# Altium schematic sheet Decoupling_Capacitors.SchDoc
size A4
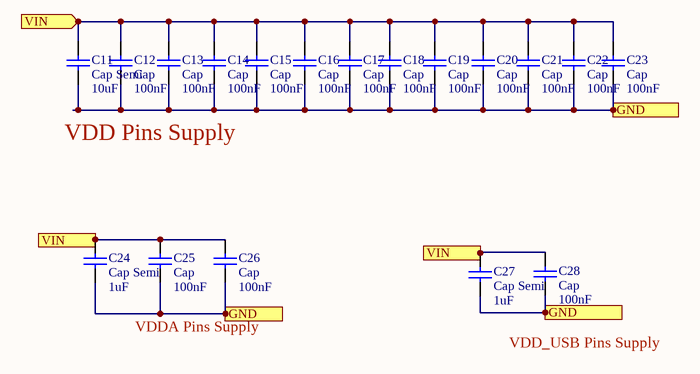
[diagram p0: Decoupling_Capacitors.SchDoc]

## Parts
C11  Cap Semi  value 10uF  [CAP_TANT1206]
C12  Cap  value 100nF  [0402]
C13  Cap  value 100nF  [0402]
C14  Cap  value 100nF  [0402]
C15  Cap  value 100nF  [0402]
C16  Cap  value 100nF  [0402]
C17  Cap  value 100nF  [0402]
C18  Cap  value 100nF  [0402]
C19  Cap  value 100nF  [0402]
C20  Cap  value 100nF  [0402]
C21  Cap  value 100nF  [0402]
C22  Cap  value 100nF  [0402]
C23  Cap  value 100nF  [0402]
C24  Cap Semi  value 1uF  [0402]
C25  Cap  value 100nF  [0402]
C26  Cap  value 100nF  [0402]
C27  Cap Semi  value 1uF  [0402]
C28  Cap  value 100nF  [0402]

## Ports
GND (out), VIN, VIN (in)

## Nets
GND: C11.1 C12.1 C13.1 C14.1 C15.1 C16.1 C17.1 C18.1 C19.1 C20.1 C21.1 C22.1 C23.1 C25.1 C26.1 C27.1 C28.1 ; port GND
VIN: C11.2 C12.2 C13.2 C14.2 C15.2 C16.2 C17.2 C18.2 C19.2 C20.2 C21.2 C22.2 C23.2 C24.2 C25.2 C26.2 C27.2 C28.2 ; port VIN

Not connected (* = marked no-connect by the designer): C24 1

## Notes on the sheet
- VDD Pins Supply
- VDDA Pins Supply
- VDD_USB Pins Supply

## Library data of the parts
C11 = Cap Semi: Tantalum Capacitors - Solid SMD 16V 10uF 1206 10% ESR=3Ohms; Mfr. No: T491A106K016AT; PackageReference: SMD-1206(3216 metric); PackageDescription: Tantalum Capacitor; Mouser No: 80-T491A106K016
C12-C23 C25 C26 C28 = Cap: Multilayer Ceramic Capacitors MLCC - SMD/SMT 16volts 0.1uF 20% X7R; Mfr. No: C0402C104M4RACAUTO; PackageReference: SMD-0402 (1005 metric); PackageDescription: Ceramic Capacitor; Mouser No: 80-C0402C104M4RAUTO
C24 C27 = Cap Semi: Multilayer Ceramic Capacitors MLCC - SMD/SMT CGB 0402 16V 1uF JB 20%; Mfr. No: CGB2A1JB1C105M033BC; PackageReference: SMD-0402(1005 metric); PackageDescription: Chip Capacitor; Mouser No: 810-CGB2A1JB1C105M0C